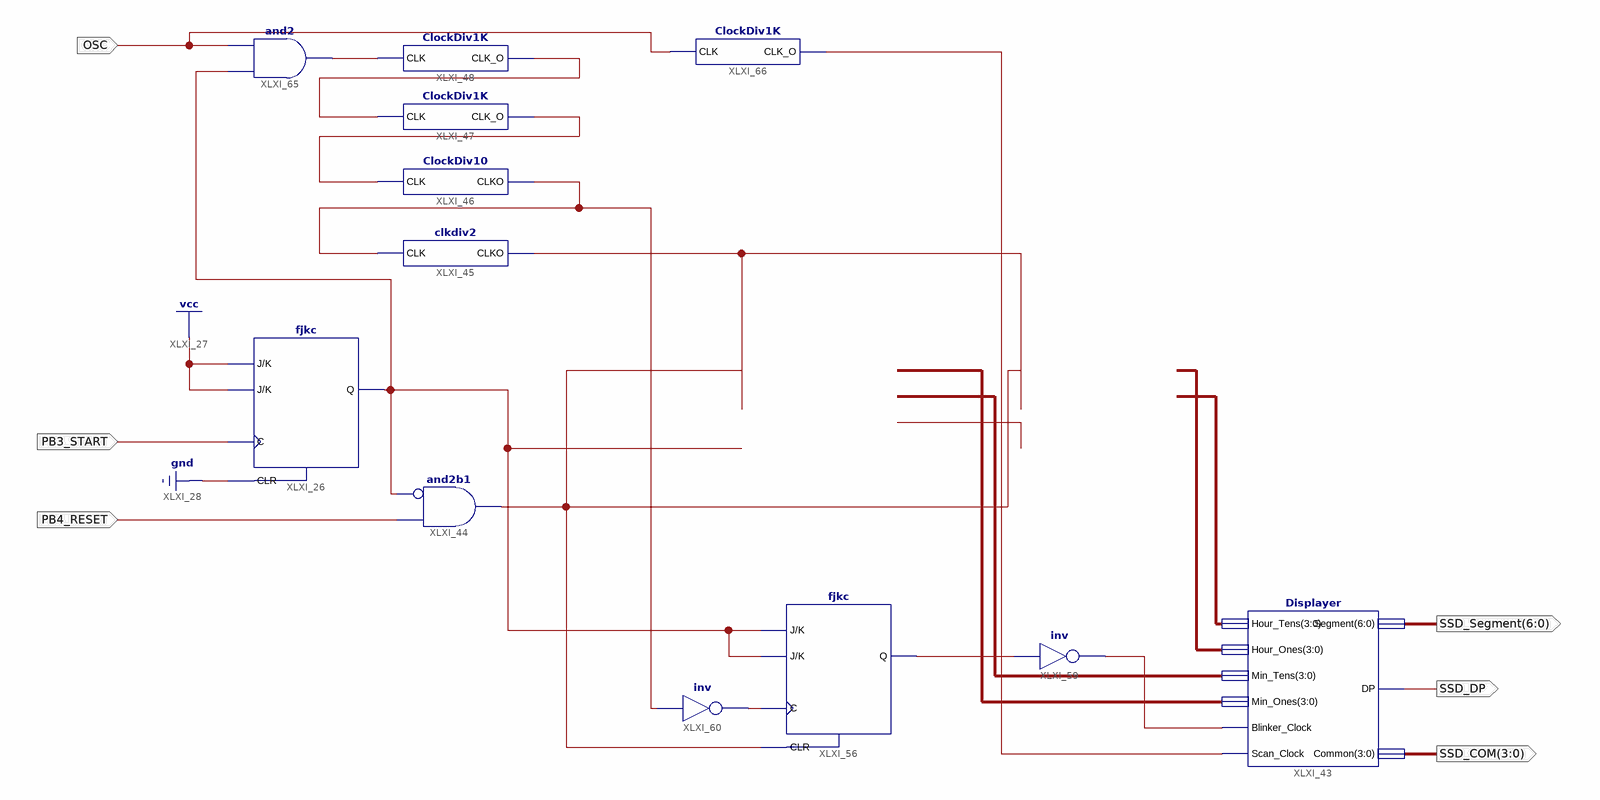
[diagram p0: schematic sheet 1]
// Xilinx ISE schematic main.sch (spartan6) as structural Verilog: 12 symbols, 6 ports
module main (
  input  PB3_START,
  input  PB4_RESET,
  input  OSC,
  output [6:0] SSD_Segment,
  output [3:0] SSD_COM,
  output SSD_DP
);

  wire XLXN_42, XLXN_117, XLXN_10789, XLXN_10791, XLXN_10793, XLXN_10797, XLXN_10846, XLXN_10848, XLXN_10879,
       XLXN_10880, XLXN_10881;
  wire [3:0] XLXN_98, XLXN_99, XLXN_100, XLXN_101;

  fjkc XLXI_26 (.C(PB3_START), .CLR(1'b0), .J(1'b1), .K(1'b1), .Q(XLXN_10880));
  and XLXI_44 (XLXN_10789, ~XLXN_10880, PB4_RESET);  // and2b1
  fjkc XLXI_56 (.C(XLXN_10848), .CLR(XLXN_10789), .J(XLXN_10880), .K(XLXN_10880), .Q(XLXN_10846));
  Displayer XLXI_43 (
    .Hour_Tens(XLXN_101), .Hour_Ones(XLXN_100), .Min_Tens(XLXN_99), .Min_Ones(XLXN_98),
    .Blinker_Clock(XLXN_10791), .Scan_Clock(XLXN_10881), .Segment(SSD_Segment), .DP(SSD_DP), .Common(SSD_COM));
  not XLXI_59 (XLXN_10791, XLXN_10846);
  not XLXI_60 (XLXN_10848, XLXN_10793);
  ClockDiv1K XLXI_47 (.CLK(XLXN_117), .CLK_O(XLXN_42));
  ClockDiv1K XLXI_48 (.CLK(XLXN_10879), .CLK_O(XLXN_117));
  ClockDiv10 XLXI_46 (.CLK(XLXN_42), .CLKO(XLXN_10793));
  clkdiv2 XLXI_45 (.CLK(XLXN_10793), .CLKO(XLXN_10797));
  and XLXI_65 (XLXN_10879, XLXN_10880, OSC);
  ClockDiv1K XLXI_66 (.CLK(OSC), .CLK_O(XLXN_10881));
endmodule
